# Altium schematic sheet at24c02_SST25FV080B_OLED.SchDoc: STM32F208外部存储模块及OLED屏接口
size A4; Date: 2016-7-18; Author: Veiko; CompanyName: 艺嵌科技; DrawnBy: Veiko; DocumentNumber: 001; Revision: V1.0; CurrentTime: 14:27; DocumentName: STM32F208外部存储模块及OLED屏接口
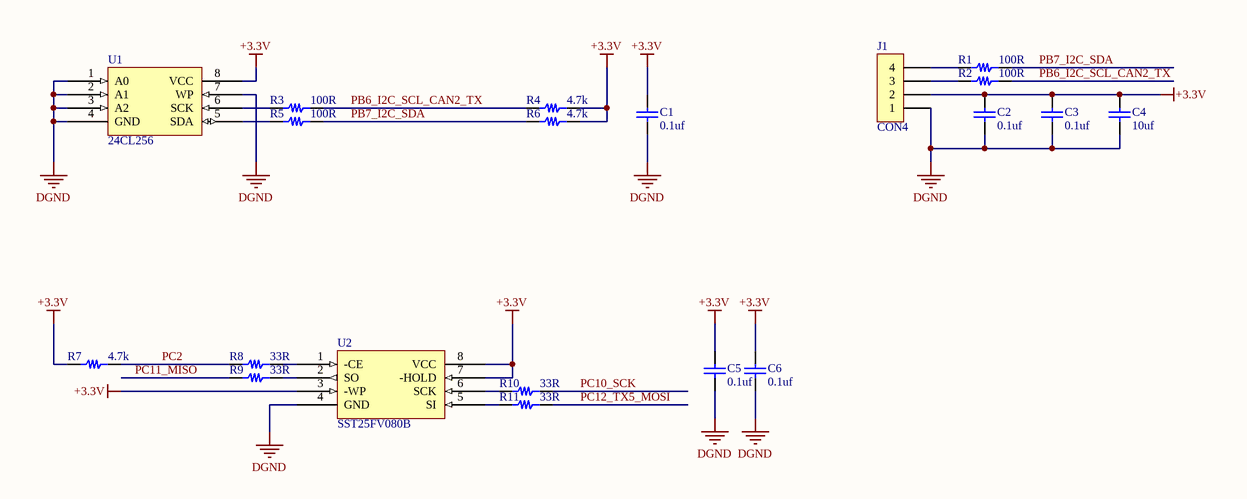
[diagram p0: at24c02_SST25FV080B_OLED.SchDoc]

## Parts
C1  0.1uf  [0805C]
C2  0.1uf  [0805C]
C3  0.1uf  [0805C]
C4  10uf  [0805C]
C5  0.1uf  [0805C]
C6  0.1uf  [0805C]
J1  CON4  [SIP4-2.54MM]
R1  100R  [0805_small]
R2  100R  [0805_small]
R3  100R  [0805_small]
R4  4.7k  [0805_small]
R5  100R  [0805_small]
R6  4.7k  [0805_small]
R7  4.7k  [0805_small]
R8  33R  [0805_small]
R9  33R  [0805_small]
R10  33R  [0805_small]
R11  33R  [0805_small]
U1  24CL256  [SO-8]
U2  SST25FV080B  [SO-8]

## Nets
+3.3V: C1.2 C2.2 C3.2 C4.2 C5.2 C6.2 J1.2 R4.1 R6.1 R7.2 U1.8(VCC) U2.3(-WP) U2.7(-HOLD) U2.8(VCC)
DGND: C1.1 C2.1 C3.1 C4.1 C5.1 C6.1 J1.1 U1.1(A0) U1.2(A1) U1.3(A2) U1.4(GND) U1.7(WP) U2.4(GND)
PB6_I2C_SCL_CAN2_TX: R2.1 R3.1 R4.2
PB7_I2C_SDA: R1.1 R5.1 R6.2
PC2: R7.1 R8.2
PC10_SCK: R10.1
PC11_MISO: R9.2
PC12_TX5_MOSI: R11.1
NetJ1_3: J1.3 R2.2
NetJ1_4: J1.4 R1.2
NetR3_2: R3.2 U1.6(SCK)
NetR5_2: R5.2 U1.5(SDA)
NetR8_1: R8.1 U2.1(-CE)
NetR9_1: R9.1 U2.2(SO)
NetR10_2: R10.2 U2.6(SCK)
NetR11_2: R11.2 U2.5(SI)

## Library data of the parts
C1-C6 = Cap: 贴片电容; Value: 100pF; Published: 8-Jun-2000; LatestRevisionDate: 17-Jul-2002; LatestRevisionNote: Re-released for DXP Platform.; PackageReference: RAD-0.3; Publisher: Altium Limited
J1 = CON4: Connector
R1-R11 = Res: 电阻; Value: 230k; Published: 24-Mar-1999; LatestRevisionDate: 29-May-2009; LatestRevisionNote: IPC-7351 Footprint Added.; PackageVersion: Mar-2003; PackageReference: 6-0805; Publisher: Altium Limited; PackageDescription: Chip Resistor 0805 Case Size; Code_IPC: RESC2012